# Altium schematic sheet I2C.SchDoc
size A3; SheetNumber: 20; SheetTotal: 29
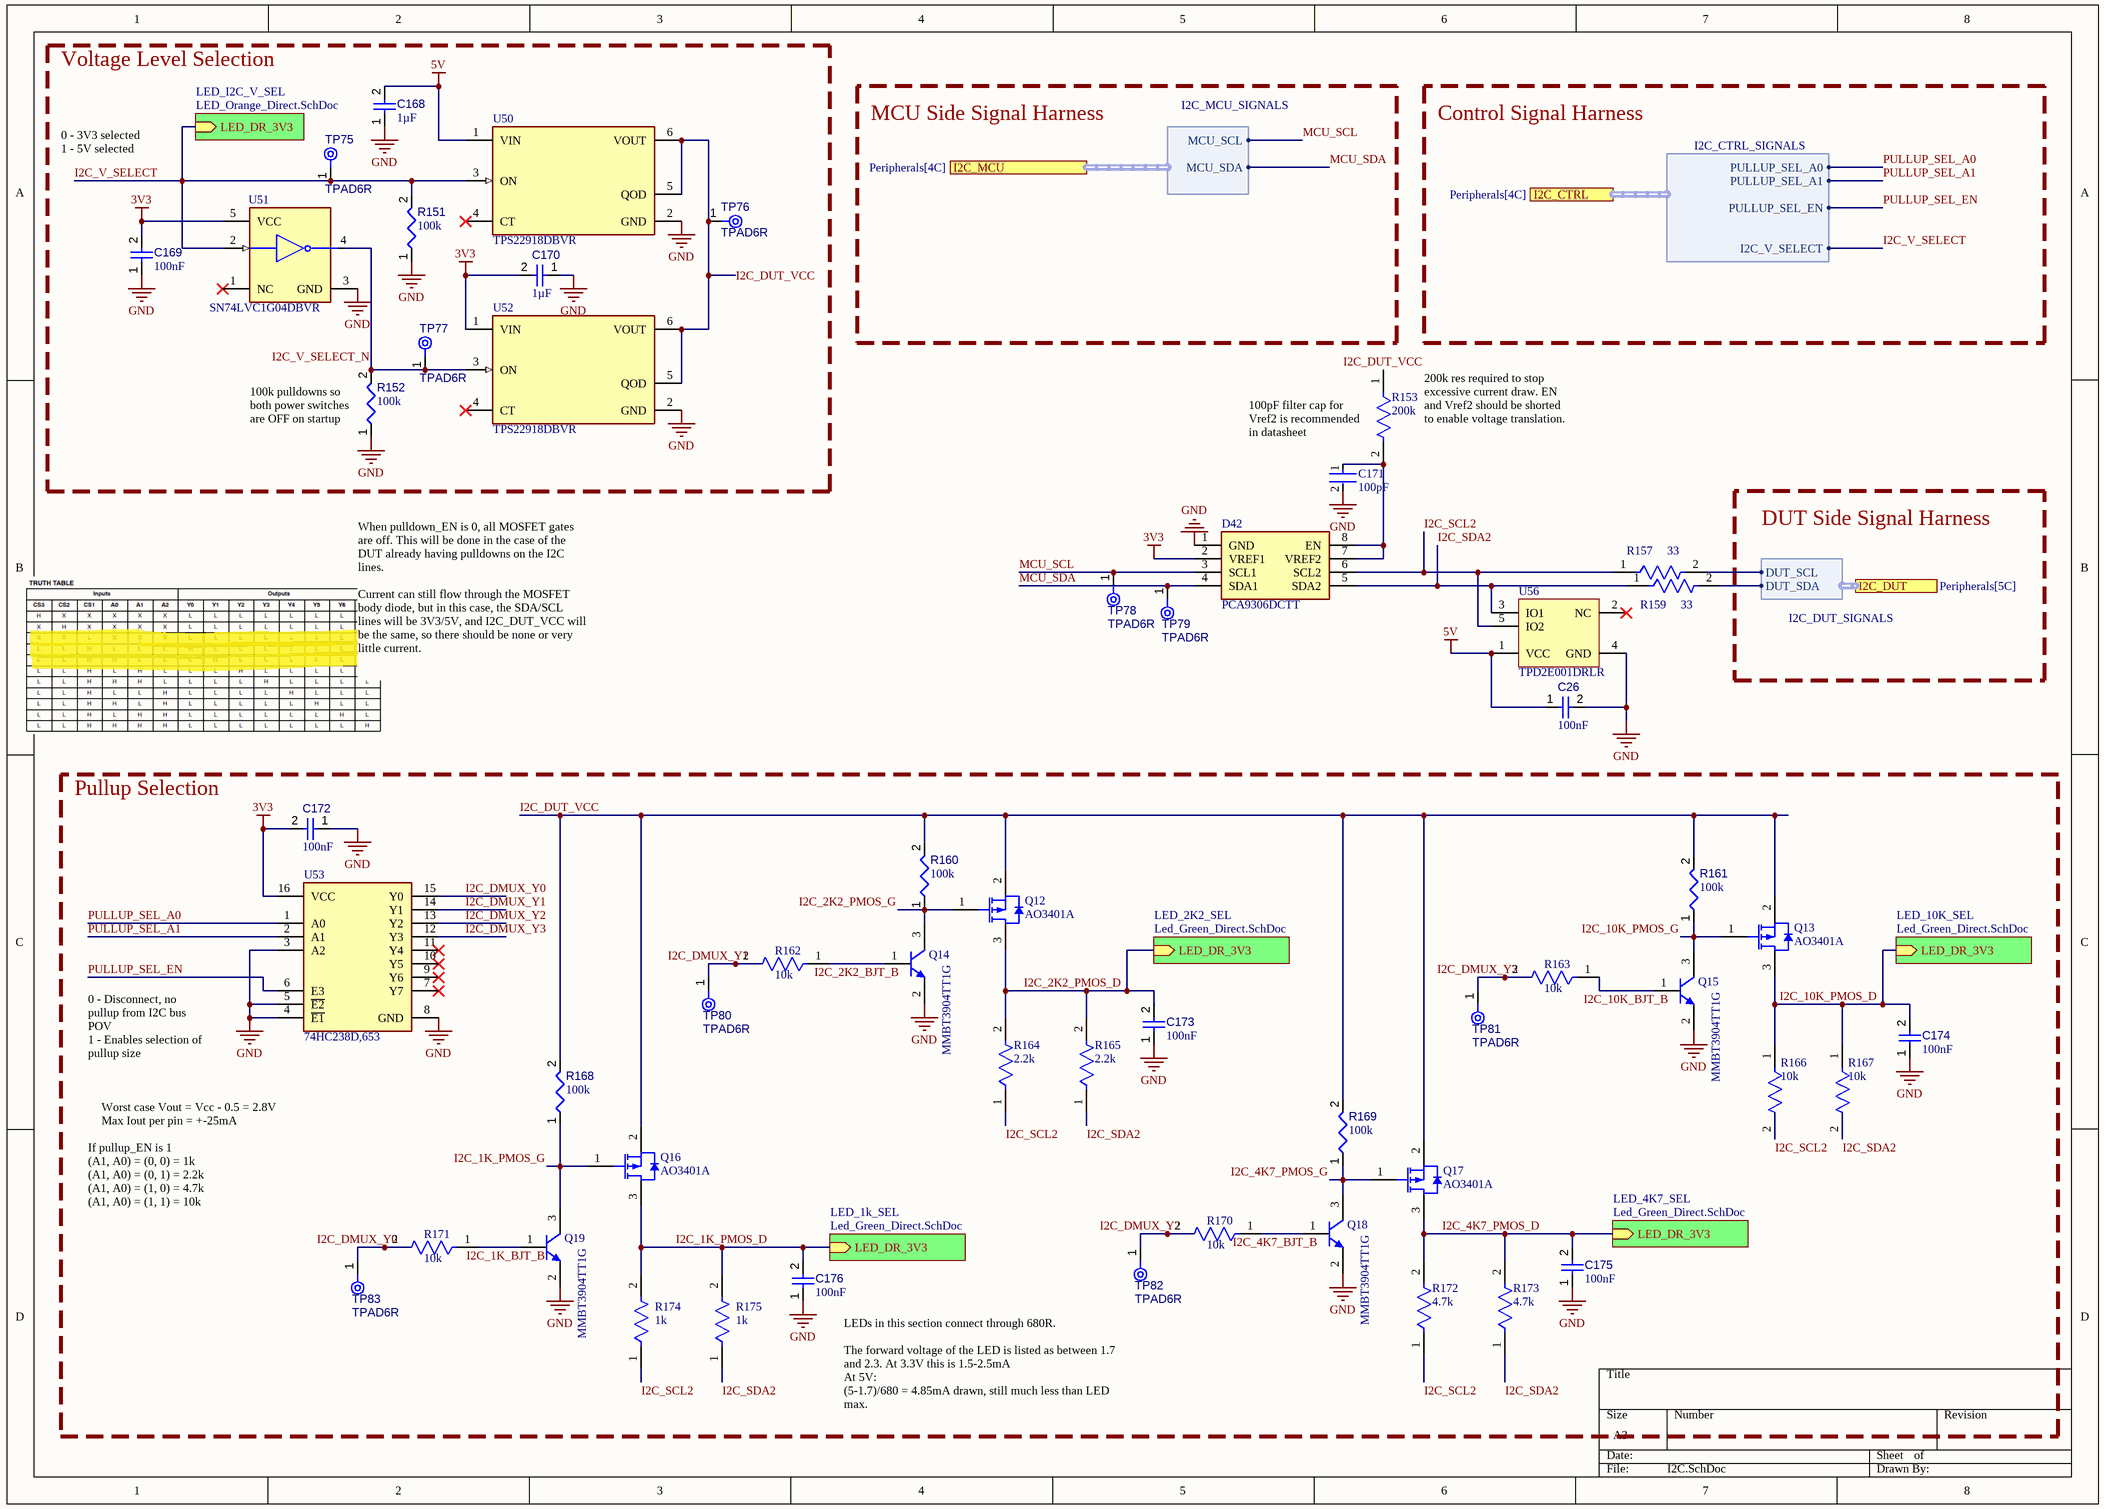
[diagram p0: I2C.SchDoc]

## Parts
C26  value 100nF  [CAPC1608X90X40NL10T20]  (hidden comment: Capacitor 100 nF +/-10% 50 V 0603)
C168  value 1µF  [CAPC1608X90X40LL10T20]  (hidden comment: Capacitor 1 uF +/- 10% 25 V 0603)
C169  value 100nF  [CAPC1608X90X40NL10T20]  (hidden comment: Capacitor 100 nF +/-10% 50 V 0603)
C170  value 1µF  [CAPC1608X90X40LL10T20]  (hidden comment: Capacitor 1 uF +/- 10% 25 V 0603)
C171  value 100pF  [FP-C0603C-CF-IPC_B]  (hidden comment: C0603C101F5GACTU)
C172  value 100nF  [CAPC1608X90X40NL10T20]  (hidden comment: Capacitor 100 nF +/-10% 50 V 0603)
C173  value 100nF  [CAPC1608X90X40NL10T20]  (hidden comment: Capacitor 100 nF +/-10% 50 V 0603)
C174  value 100nF  [CAPC1608X90X40NL10T20]  (hidden comment: Capacitor 100 nF +/-10% 50 V 0603)
C175  value 100nF  [CAPC1608X90X40NL10T20]  (hidden comment: Capacitor 100 nF +/-10% 50 V 0603)
C176  value 100nF  [CAPC1608X90X40NL10T20]  (hidden comment: Capacitor 100 nF +/-10% 50 V 0603)
D42  PCA9306DCTT  [SOP65P400X130-8N]
Q12  AO3401A  [AO-SOT-23-3L_V]
Q13  AO3401A  [AO-SOT-23-3L_V]
Q14  MMBT3904TT1G  [ONSC-SC-75-3-463-01_V]
Q15  MMBT3904TT1G  [ONSC-SC-75-3-463-01_V]
Q16  AO3401A  [AO-SOT-23-3L_V]
Q17  AO3401A  [AO-SOT-23-3L_V]
Q18  MMBT3904TT1G  [ONSC-SC-75-3-463-01_V]
Q19  MMBT3904TT1G  [ONSC-SC-75-3-463-01_V]
R151  value 100k  [FP-AC0603-IPC_C]  (hidden comment: AC0603FR-07100KL)
R152  value 100k  [FP-AC0603-IPC_C]  (hidden comment: AC0603FR-07100KL)
R153  value 200k  [FP-AT0603-IPC_A]  (hidden comment: AT0603BRD07200KL)
R157  value 33  [FP-AC0603-IPC_C]  (hidden comment: AC0603FR-0733RL)
R159  value 33  [FP-AC0603-IPC_C]  (hidden comment: AC0603FR-0733RL)
R160  value 100k  [FP-AC0603-IPC_C]  (hidden comment: AC0603FR-07100KL)
R161  value 100k  [FP-AC0603-IPC_C]  (hidden comment: AC0603FR-07100KL)
R162  value 10k  [FP-RT0603-IPC_C]  (hidden comment: RT0603BRD0710KL)
R163  value 10k  [FP-RT0603-IPC_C]  (hidden comment: RT0603BRD0710KL)
R164  value 2.2k  [FP-RT0603-IPC_C]  (hidden comment: RT0603BRD072K2L)
R165  value 2.2k  [FP-RT0603-IPC_C]  (hidden comment: RT0603BRD072K2L)
R166  value 10k  [FP-RT0603-IPC_C]  (hidden comment: RT0603BRD0710KL)
R167  value 10k  [FP-RT0603-IPC_C]  (hidden comment: RT0603BRD0710KL)
R168  value 100k  [FP-AC0603-IPC_C]  (hidden comment: AC0603FR-07100KL)
R169  value 100k  [FP-AC0603-IPC_C]  (hidden comment: AC0603FR-07100KL)
R170  value 10k  [FP-RT0603-IPC_C]  (hidden comment: RT0603BRD0710KL)
R171  value 10k  [FP-RT0603-IPC_C]  (hidden comment: RT0603BRD0710KL)
R172  value 4.7k  [FP-RT0603-IPC_C]  (hidden comment: RT0603BRD074K7L)
R173  value 4.7k  [FP-RT0603-IPC_C]  (hidden comment: RT0603BRD074K7L)
R174  value 1k  [FP-RT0603-IPC_B]  (hidden comment: RT0603BRD071KL)
R175  value 1k  [FP-RT0603-IPC_B]  (hidden comment: RT0603BRD071KL)
TP75  TPAD6R  [TP06R]  (no BOM)
TP76  TPAD6R  [TP06R]  (no BOM)
TP77  TPAD6R  [TP06R]  (no BOM)
TP78  TPAD6R  [TP06R]  (no BOM)
TP79  TPAD6R  [TP06R]  (no BOM)
TP80  TPAD6R  [TP06R]  (no BOM)
TP81  TPAD6R  [TP06R]  (no BOM)
TP82  TPAD6R  [TP06R]  (no BOM)
TP83  TPAD6R  [TP06R]  (no BOM)
U50  TPS22918DBVR  [FP-DBV0006A-IPC_B]
U51  SN74LVC1G04DBVR  [FP-DBV0005A-IPC_B]
U52  TPS22918DBVR  [FP-DBV0006A-IPC_B]
U53  74HC238D,653  [74HC238D653]
U56  TPD2E001DRLR  [DRL0005A_M]

## Blocks framed on the sheet
Voltage Level Selection: C168-C170 R151 R152 TP75-TP77 U50-U52
Pullup Selection: C172-C176 Q12-Q19 R160-R175 TP80-TP83 U53

## Sub-sheets
LED_1k_SEL = Led_Green_Direct.SchDoc: LED_DR_3V3 (in)
LED_2K2_SEL = Led_Green_Direct.SchDoc: LED_DR_3V3 (in)
LED_4K7_SEL = Led_Green_Direct.SchDoc: LED_DR_3V3 (in)
LED_10K_SEL = Led_Green_Direct.SchDoc: LED_DR_3V3 (in)
LED_I2C_V_SEL = LED_Orange_Direct.SchDoc: LED_DR_3V3 (in)

## Ports
I2C_CTRL (harness I2C_CTRL_SIGNALS, see Peripherals[4C]), I2C_DUT (harness I2C_DUT_SIGNALS, see Peripherals[5C]), I2C_MCU (harness I2C_MCU_SIGNALS, see Peripherals[4C])

## Harnesses
I2C_MCU_SIGNALS: MCU_SCL, MCU_SDA
I2C_DUT_SIGNALS: DUT_SCL, DUT_SDA
I2C_CTRL_SIGNALS: PULLUP_SEL_A0, PULLUP_SEL_A1, PULLUP_SEL_EN, I2C_V_SELECT

## Nets
3V3: C169.2 C170.2 C172.2 D42.2(VREF1) U51.5(VCC) U52.1(VIN) U53.16(VCC)
5V: C26.1 C168.2 U50.1(VIN) U56.1(VCC)
GND: C26.2 C168.1 C169.1 C170.1 C171.2 C172.1 C173.1 C174.1 C175.1 C176.1 D42.1(GND) Q14.2(E) Q15.2(E) Q18.2(E) Q19.2(E) R151.1 R152.1 U50.2(GND) U51.3(GND) U52.2(GND) U53.3(A2) U53.4(~{E1}) U53.5(~{E2}) U53.8(GND) U56.4(GND)
I2C_1K_BJT_B: Q19.1(B) R171.1
I2C_1K_PMOS_D: C176.2 Q16.3(DRAIN) R174.2 R175.2 ; sheet LED_1k_SEL/LED_DR_3V3
I2C_1K_PMOS_G: Q16.1(GATE) Q19.3(C) R168.1
I2C_2K2_BJT_B: Q14.1(B) R162.1
I2C_2K2_PMOS_D: C173.2 Q12.3(DRAIN) R164.2 R165.2 ; sheet LED_2K2_SEL/LED_DR_3V3
I2C_2K2_PMOS_G: Q12.1(GATE) Q14.3(C) R160.1
I2C_4K7_BJT_B: Q18.1(B) R170.1
I2C_4K7_PMOS_D: C175.2 Q17.3(DRAIN) R172.2 R173.2 ; sheet LED_4K7_SEL/LED_DR_3V3
I2C_4K7_PMOS_G: Q17.1(GATE) Q18.3(C) R169.1
I2C_10K_BJT_B: Q15.1(B) R163.1
I2C_10K_PMOS_D: C174.2 Q13.3(DRAIN) R166.1 R167.1 ; sheet LED_10K_SEL/LED_DR_3V3
I2C_10K_PMOS_G: Q13.1(GATE) Q15.3(C) R161.1
I2C_DMUX_Y0: R171.2 TP83.1(TP) U53.15(Y0)
I2C_DMUX_Y1: R162.2 TP80.1(TP) U53.14(Y1)
I2C_DMUX_Y2: R170.2 TP82.1(TP) U53.13(Y2)
I2C_DMUX_Y3: R163.2 TP81.1(TP) U53.12(Y3)
I2C_DUT_VCC: Q12.2(SOURCE) Q13.2(SOURCE) Q16.2(SOURCE) Q17.2(SOURCE) R153.1 R160.2 R161.2 R168.2 R169.2 TP76.1(TP) U50.5(QOD) U50.6(VOUT) U52.5(QOD) U52.6(VOUT)
I2C_SCL2: D42.6(SCL2) R157.1 R164.1 R166.2 R172.1 R174.1 U56.5(IO2)
I2C_SDA2: D42.5(SDA2) R159.1 R165.1 R167.2 R173.1 R175.1 U56.3(IO1)
I2C_V_SELECT: R151.2 TP75.1(TP) U50.3(ON) U51.2(A) ; sheet LED_I2C_V_SEL/LED_DR_3V3, port I2C_CTRL.I2C_V_SELECT
I2C_V_SELECT_N: R152.2 TP77.1(TP) U51.4(Y) U52.3(ON)
MCU_SCL: D42.3(SCL1) TP78.1(TP) ; port I2C_MCU.MCU_SCL
MCU_SDA: D42.4(SDA1) TP79.1(TP) ; port I2C_MCU.MCU_SDA
PULLUP_SEL_A0: U53.1(A0) ; port I2C_CTRL.PULLUP_SEL_A0
PULLUP_SEL_A1: U53.2(A1) ; port I2C_CTRL.PULLUP_SEL_A1
PULLUP_SEL_EN: U53.6(E3) ; port I2C_CTRL.PULLUP_SEL_EN
NetC171_1: C171.1 D42.7(VREF2) D42.8(EN) R153.2
NetR157_2: R157.2 ; port I2C_DUT.DUT_SCL
NetR159_2: R159.2 ; port I2C_DUT.DUT_SDA

Not connected (* = marked no-connect by the designer): U50 4(CT)*; U51 1(NC)*; U52 4(CT)*; U53 7(Y7)* 9(Y6)* 10(Y5)* 11(Y4)*; U56 2(NC)*

## Notes on the sheet
- 0 - 3V3 selected
  1 - 5V selected
- MCU Side Signal Harness
- Control Signal Harness
- (near R152) 100k pulldowns so both power switches are OFF on startup
- 100pF filter cap for Vref2 is recommended in datasheet
- (near R153) 200k res required to stop excessive current draw. EN and Vref2 should be shorted to enable voltage translation.
- DUT Side Signal Harness
- When pulldown_EN is 0, all MOSFET gates are off. This will be done in the case of the DUT already having pulldowns on the I2C lines.
  Current can still flow through the MOSFET body diode, but in this case, the SDA/SCL lines will be 3V3/5V, and I2C_DUT_VCC will be the same, so there should be none or very little current.
- 0 - Disconnect, no pullup from I2C bus POV
  1 - Enables selection of pullup size
- Worst case Vout = Vcc - 0.5 = 2.8V
  Max Iout per pin = +-25mA
- If pullup_EN is 1
  (A1, A0) = (0, 0) = 1k
  (A1, A0) = (0, 1) = 2.2k
  (A1, A0) = (1, 0) = 4.7k
  (A1, A0) = (1, 1) = 10k
- LEDs in this section connect through 680R.
  The forward voltage of the LED is listed as between 1.7 and 2.3. At 3.3V this is 1.5-2.5mA
  At 5V:
  (5-1.7)/680 = 4.85mA drawn, still much less than LED max.

## Library data of the parts
C26 C169 C172-C176 = CMP-001-00017-6: Chip Capacitor, 100 nF, +/- 10%, 50 V, 0603 (1608 Metric); Voltage Rating: 50V; Capacitor Type: Ceramic; Tolerance: 10%; Mounting Technology: SM; Max Operating Temperature: 125°C; RoHS Compliant: True; Pins: 2; Case/Package: 0603; Min Operating Temperature: -55°C
C168 C170 = CMP-001-00005-6: Chip Capacitor, 1 uF, +/- 10%, 25 V, 0603 (1608 Metric); Capacitor Type: Ceramic; Voltage Rating: 25V; Pins: 2; Mounting Technology: SM; RoHS Compliant: True; Max Operating Temperature: 125°C; Case/Package: 0603; Min Operating Temperature: -55°C; Tolerance: 10%
C171 = CMP-001-00144-1: 50V 100pF C0G ±1% 0603 Multilayer Ceramic Capacitors MLCC - SMD/SMT ROHS; Temperature Coefficient: 30ppm/°C; Dissipation Factor: 0.1%; Lead Free: Lead Free; Width: 800µm; Tolerance: 1%; Schedule B: 8532240020, 8532240020; Introduction Date: 2008-06-06; Harmonized Tariff Schedule (HTS) Code: 8532.24.00.20; Voltage Rating (DC): 50V; Lifecycle Status: Production; Number of Terminals: 2; Height: 800µm; REACH SVHC: Yes; Dielectric Material: Ceramic; Country of Origin: Mexico; Voltage Rating: 50V; Mounting Technology: Surface Mount; Length: 1.6mm; China RoHS: Compliant; RoHS: Compliant; Case/Package: 0603; Max Operating Temperature: 125°C; Export Control Classification Number (ECCN) Code: EAR99; Dielectric: C0G; Material: Ceramic; Min Operating Temperature: -55°C; Case Code (Imperial): 0603; Case Code (Metric): 1608; Depth: 800µm; Lead Pitch: 700µm; Packaging: Cut Tape; Termination: SMD/SMT; Thickness: 863.6µm
D42 = CMP-031-00020-1: 2-Bit Bidirectional I2C Bus and SMBus Voltage-Level Shifter; Manufacturer_Name: Texas Instruments; Mouser Price/Stock: https://www.mouser.co.uk/ProductDetail/Texas-Instruments/PCA9306DCTT?qs=wgAEGBTxy7mcoWDi%252ByJu0w%3D%3D; Mouser Part Number: 595-PCA9306DCTT; Manufacturer_Part_Number: PCA9306DCTT; Design Item ID: PCA9306DCTT; Height: 1.3mm; Datasheet Link: http://www.ti.com/lit/gpn/pca9306; Arrow Part Number: PCA9306DCTT; Arrow Price/Stock: https://www.arrow.com/en/products/pca9306dctt/texas-instruments.html?utm_currency=USD&region=nac; Source: MAX17643ATC+.SchLib
Q12 Q13 Q16 Q17 = CMP-013-00048-1: Transistor: P-MOSFET; unipolar; -30V; 4, 2A; 1, 4W; 85 mOhm; ; -55+150 st.C; SMD; SOT23; Rds On Max: 44mΩ; Turn-On Delay Time: 6.5ns; Max Junction Temperature (Tj): 150°C; Threshold Voltage: -900mV; Power Dissipation: 1.4W; Gate to Source Voltage (Vgs): 12V; Turn-Off Delay Time: 41ns; Number of Elements: 1; Continuous Drain Current (ID): 4A; Min Breakdown Voltage: 30V; Input Capacitance: 1.2nF; Drain to Source Resistance: 50mΩ; Drain to Source Voltage (Vdss): -30V; RoHS: Compliant; Export Control Classification Number (ECCN) Code: EAR99; Max Operating Temperature: 150°C; Number of Terminals: 3; Schedule B: 8541290080, 8541290080; Drain to Source Breakdown Voltage: -30V; Case/Package: TO-236-3; Introduction Date: 2007-04-10; Mounting Technology: Surface Mount; Max Power Dissipation: 1.4W; Height: 1.25mm; Lead Free: Lead Free; Min Operating Temperature: -55°C; Lifecycle Status: Production; Number of Channels: 1; Radiation Hardening: No; REACH SVHC: Yes; Pins: 3; Country of Origin: Mainland China
Q14 Q15 Q18 Q19 = CMP-013-00039-1: on Semi MMBT3904TT1G NPN Bipolar Transistor, 0.2 A, 40 V, 3-PIN SOT-416; Frequency: 300MHz; Min Operating Temperature: -55°C; Max Operating Temperature: 150°C; Case/Package: SOT-416; Pins: 3
R151 R152 R160 R161 R168 R169 = CMP-009-00345-3: Res Thick Film 0603 100K Ohm 1% 0.1W(1/10W) ±100ppm/C Pad SMD T/R Automotive; Voltage Rating: 75V; Max Power Dissipation: 100mW; Temperature Coefficient: 100ppm/°C; Max Operating Temperature: 155°C; Tolerance: 1%; Case/Package: 0603; Mounting Technology: Surface Mount; Min Operating Temperature: -55°C; Case Code (Imperial): 0603; Case Code (Metric): 1608; China RoHS: Non-Compliant; Composition: Thick Film; Country of Origin: Mainland China, Taiwan; Depth: 800µm; Export Control Classification Number (ECCN) Code: EAR99; Features: Anti-Sulfur, Automotive AEC-Q200, Moisture Resistant; Harmonized Tariff Schedule (HTS) Code: 8533.21.00.30; Height: 450µm; Introduction Date: 2012-04-10; Lead Free: Lead Free; Length: 1.6mm; Lifecycle Status: Production; Military Standard: Not; Number of Terminals: 2; Number of Terminations: 2; Packaging: Tape & Reel; Power Rating: 100mW; Ratings: AEC-Q200; REACH SVHC: Yes; RoHS: Compliant; Schedule B: 8533210045, 8533210045; Termination: SMD/SMT; Width: 800µm; Working Voltage: 75V
R153 = CMP-009-00344-1: 100mW Thin Film Resistor ±25ppm/℃ ±0.1% 200kΩ 0603 Chip Resistor - Surface Mount ROHS; Working Voltage: 75V; Temperature Coefficient: 25ppm/°C; RoHS: Compliant; Width: 800µm; Country of Origin: Mainland China, Taiwan; China RoHS: Compliant; Number of Terminations: 2; Case/Package: 0603; Composition: Thin Film; Power Rating: 100mW; Introduction Date: 2015-05-11; Harmonized Tariff Schedule (HTS) Code: 8533.21.00.30; Max Operating Temperature: 155°C; Number of Terminals: 2; Height: 450µm; Length: 1.6mm; Voltage Rating: 75V; REACH SVHC: Yes; Tolerance: 0.1%; Max Power Dissipation: 100mW; Min Operating Temperature: -55°C; Features: Anti-Sulfur, Automotive AEC-Q200, Moisture Resistant; Ratings: AEC-Q200; Mounting Technology: Surface Mount; Export Control Classification Number (ECCN) Code: EAR99; Lifecycle Status: Production
R157 R159 = CMP-009-00258-1: Res Thick Film 0603 33 Ohm 1% 0.1W(1/10W) ±100ppm/C Pad SMD T/R Automotive AEC-Q200; Voltage Rating: 75V; Max Power Dissipation: 100mW; Temperature Coefficient: 100ppm/°C; Min Operating Temperature: -55°C; Tolerance: 1%; Mounting Technology: Surface Mount; Max Operating Temperature: 155°C; Case/Package: 0603; Case Code (Imperial): 0603; China RoHS: Non-Compliant; Composition: Thick Film; Country of Origin: Mainland China, Taiwan; Export Control Classification Number (ECCN) Code: EAR99; Harmonized Tariff Schedule (HTS) Code: 8533.21.00.30; Height: 450µm; Introduction Date: 2012-04-10; Length: 1.6mm; Lifecycle Status: Production; Number of Terminals: 2; Number of Terminations: 2; Power Rating: 100mW; REACH SVHC: Yes; RoHS: Compliant; Schedule B: 8533210045, 8533210045; Termination: SMD/SMT; Width: 800µm; Working Voltage: 75V; Case Code (Metric): 1608; Features: Automotive AEC-Q200, Moisture Resistant; Packaging: Tape & Reel; Power Dissipation: 100mW; Ratings: AEC-Q200
R162 R163 R166 R167 R170 R171 = CMP-009-00322-1: Res Thin Film 0603 10K Ohm 0.1% 1/10W |25ppm/|C SMD Paper T/R; Voltage Rating: 75V; Max Power Dissipation: 100mW; Temperature Coefficient: 25ppm/°C; Min Operating Temperature: -55°C; Case/Package: 0603; Mounting Technology: Surface Mount; Max Operating Temperature: 155°C; Tolerance: 0.1%; Case Code (Imperial): 0603; China RoHS: Non-Compliant; Composition: Thin Film; Country of Origin: Mainland China, Taiwan; Depth: 800µm; Export Control Classification Number (ECCN) Code: EAR99; Features: Moisture Resistant; Harmonized Tariff Schedule (HTS) Code: 8533.21.00.30; Height: 450µm; Introduction Date: 2008-06-09; Lead Free: Lead Free; Length: 1.6mm; Lifecycle Status: Production; Military Standard: Not; Number of Terminals: 2; Number of Terminations: 2; Power Rating: 100mW; REACH SVHC: Yes; RoHS: Compliant; Schedule B: 8533210045, 8533210045; Termination: SMD/SMT; Voltage Rating (DC): 75V; Weight: 2.012816mg; Width: 800µm; Working Voltage: 75V
R164 R165 = CMP-009-00292-1: 100mW Thin Film Resistor 75V ±25ppm/℃ ±0.1% 2.2kΩ 0603 Chip Resistor - Surface Mount ROHS; Voltage Rating (DC): 50V; Temperature Coefficient: 25ppm/°C; Width: 800µm; Case/Package: 0603; Lead Free: Lead Free; Voltage Rating: 75V; Max Operating Temperature: 155°C; Min Operating Temperature: -55°C; Lifecycle Status: Production; RoHS: Compliant; Schedule B: 8533210045, 8533210045; Contact Plating: Lead, Tin; Military Standard: Not; REACH SVHC: Yes; Tolerance: 0.1%; Power Rating: 100mW; Number of Terminals: 2; Height: 450µm; Length: 1.6mm; Max Power Dissipation: 100mW; Composition: Thin Film; Depth: 800µm; Number of Terminations: 2; Mounting Technology: Surface Mount; China RoHS: Non-Compliant; Features: Moisture Resistant; Case Code (Imperial): 0603; Termination: SMD/SMT; Working Voltage: 75V
R172 R173 = CMP-009-00293-1: Res Thin Film 0603 4.7K Ohm 0.1% 0.1W(1/10W) ±25ppm/C Pad SMD T/R; Temperature Coefficient: 25ppm/°C; Working Voltage: 75V; Power Rating: 100mW; Voltage Rating (DC): 50V; Tolerance: 0.1%; Country of Origin: Mainland China, Taiwan; Number of Terminations: 2; Max Operating Temperature: 155°C; Lead Free: Lead Free; Depth: 800µm; Contact Plating: Lead, Tin; Mounting Technology: Surface Mount; Max Power Dissipation: 100mW; Case Code (Imperial): 0603; Lifecycle Status: Production; Weight: 2.012816mg; Length: 1.6mm; Features: Moisture Resistant; REACH SVHC: Yes; Voltage Rating: 75V; Export Control Classification Number (ECCN) Code: EAR99; Case/Package: 0603; Min Operating Temperature: -55°C; China RoHS: Non-Compliant; Width: 800µm; Termination: SMD/SMT; Number of Terminals: 2; Military Standard: Not; Schedule B: 8533210045, 8533210045; Introduction Date: 2008-06-09; Harmonized Tariff Schedule (HTS) Code: 8533.21.00.30; Height: 450µm; Composition: Thin Film; RoHS: Compliant
R174 R175 = CMP-009-00353-1: 100mW Thin Film Resistor 75V ±25ppm/℃ ±0.1% 1kΩ 0603 Chip Resistor - Surface Mount ROHS; Voltage Rating (DC): 50V; Temperature Coefficient: 25ppm/°C; Length: 1.6mm; Depth: 800µm; Case Code (Imperial): 0603; Tolerance: 0.1%; China RoHS: Non-Compliant; Military Standard: Not; Number of Terminations: 2; Lead Free: Lead Free; Working Voltage: 75V; Case/Package: 0603; Schedule B: 8533210045, 8533210045; Number of Terminals: 2; Min Operating Temperature: -55°C; Height: 450µm; Max Operating Temperature: 155°C; Mounting Technology: Surface Mount; Width: 800µm; Composition: Thin Film; Lifecycle Status: Production; Features: Moisture Resistant; Power Rating: 100mW; Max Power Dissipation: 100mW; RoHS: Compliant; REACH SVHC: Yes; Voltage Rating: 75V; Contact Plating: Lead, Tin; Country of Origin: Mainland China, Taiwan; Export Control Classification Number (ECCN) Code: EAR99; Harmonized Tariff Schedule (HTS) Code: 8533.21.00.30; Introduction Date: 2008-06-09; Termination: SMD/SMT
TP75-TP83 = CMP-00028-00002-2: 0.6mm round; Pins: 1
U50 U52 = CMP-00000-1: 5.5-V, 2-A, 52-mΩ load switch with adj. rise time and adj. output discharge 6-SOT-23 -40 to 105; Manufacturer Lifecycle Status: ACTIVE; Max Supply Voltage: 5.5V; Turn-Off Delay Time: 2µs; Min Supply Voltage: 1V; Interface: On/Off; Rise Time: 2.54ms; Number of Drivers: 1; Turn-On Delay Time: 1.95ms; Max Output current: 2A; Output Configuration: High Side; Max Junction Temperature (Tj): 125°C; Schedule B: 8542390000, 8542390000; Length: 2.9mm; Max Operating Temperature: 105°C; Width: 1.6mm; Fall Time: 2µs; Ambient Temperature Range High: 105°C; Number of Outputs: 1; Number of Channels: 1; Thickness: 1.2mm; Lifecycle Status: Production; Lead Free: Lead Free; Case/Package: SOT-23; Height: 0m; RoHS: Compliant; Output Current: 2A; Pins: 6; Min Operating Temperature: -40°C
U51 = CMP-016-00025-1: SINGLE INVERTER GATE Inverter, LVC/LCX/Z Series, 1-Func, 1-Input, CMOS, PDSO5; Manufacturer Lifecycle Status: ACTIVE; Number of Bits: 1; Logic Function: Inverting; Nominal Supply Current: 10µA; Frequency: 150MHz; Max Output current: 32mA; Min Supply Voltage: 1.65V; Schmitt Trigger Input: No; High Level Output Current: -32mA; Max Supply Voltage: 5.5V; Turn-On Delay Time: 7.5ns; Propagation Delay: 3.7ns; Pins: 5; RoHS: Compliant; Max Operating Temperature: 125°C; Lifecycle Status: Production; Number of Gates: 1; Width: 1.6mm; Number of Outputs: 1; Min Operating Temperature: -40°C; REACH SVHC: No; Height: 1.45mm; Radiation Hardening: No; Ambient Temperature Range High: 125°C; Number of Channels: 1; Quiescent Current: 10µA; Number of Inputs: 1; Number of Elements: 1; Lead Free: Lead Free; Number of Circuits: 1; Thickness: 1.2mm; Packaging: Cut Tape; Contact Plating: Tin; Weight: 15.790684mg; Length: 2.9mm; Schedule B: 8542390000, 8542390000; Mounting Technology: Surface Mount; Output Current: 32mA; Low Level Output Current: 32mA; Termination: SMD/SMT; Case/Package: SOT-23
U53 = CMP-031-00027-2: 74HC(T)238 - 3-to-8 line decoder/demultiplexer@en-us; Manufacturer_Name: Nexperia; Height: 1.75mm; Design Item ID: 74HC238D,653; Manufacturer_Part_Number: 74HC238D,653; Mouser Part Number: 771-74HC238D-T; Arrow Part Number: 74HC238D,653; Arrow Price/Stock: https://www.arrow.com/en/products/74hc238d653/nexperia.html?utm_currency=USD&region=europe; Mouser Price/Stock: https://www.mouser.co.uk/ProductDetail/Nexperia/74HC238D653?qs=P62ublwmbi8dvjtlyD3gOA%3D%3D; Datasheet Link: https://assets.nexperia.com/documents/data-sheet/74HC_HCT238.pdf; Source: MAX17643ATC+.SchLib
U56 = CMP-004-00058-1: 11V Unidirectional 5.5V SOT-553-5 ESD and Surge Protection (TVS/ESD) ROHS; Manufacturer Lifecycle Status: ACTIVE; Leakage Current: 1nA; Power Line Protection: Yes; Interface: Ethernet, LVDS; Element Configuration: Dual; Number of Channels: 2; Min Supply Voltage: 900mV; Clamping Voltage: 105.5V; Max Junction Temperature (Tj): 150°C; Peak Pulse Current: 10A; Value: 1.5pF; REACH SVHC: No; Width: 1.2mm; Weight: 2.806603mg; Pins: 5; Min Operating Temperature: -40°C; Breakdown Voltage: 11V; Lifecycle Status: Production; RoHS: Compliant; Termination: SMD/SMT; Working Voltage: 5.5V; Radiation Hardening: No; Thickness: 550µm; Length: 1.6mm; Contact Plating: Gold; Number of Outputs: 2; Max Operating Temperature: 85°C; Height: 0m; Min Breakdown Voltage: 11V; Polarity: Unidirectional; Ambient Temperature Range High: 85°C; Lead Free: Lead Free; Depth: 1.2mm; Schedule B: 8541100080, 8541100080; Reverse Standoff Voltage: 5.5V; Operating Supply Voltage: 5.5V; Max Supply Voltage: 5.5V; Number of Bidirectional Channels: 2; Direction: Unidirectional; Case/Package: SOT